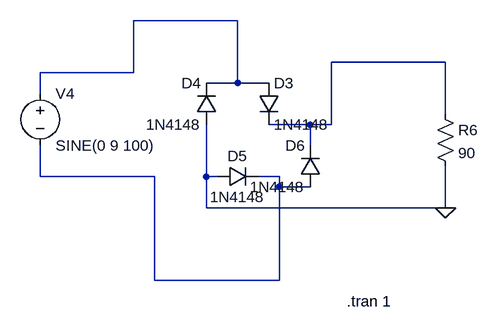
[diagram p0: schematic RectificationDraft.asc]
RectificationDraft.asc, the LTspice schematic file:
Version 4
SHEET 1 1012 680
WIRE 288 -576 128 -576
WIRE 608 -512 432 -512
WIRE 128 -496 128 -576
WIRE 128 -496 -16 -496
WIRE 288 -480 288 -576
WIRE 288 -480 240 -480
WIRE 336 -480 288 -480
WIRE -16 -464 -16 -496
WIRE 608 -432 608 -512
WIRE 400 -416 336 -416
WIRE 432 -416 432 -512
WIRE 432 -416 400 -416
WIRE 400 -384 400 -416
WIRE -16 -336 -16 -384
WIRE 160 -336 -16 -336
WIRE 240 -336 240 -416
WIRE 256 -336 240 -336
WIRE 352 -336 320 -336
WIRE 352 -320 352 -336
WIRE 400 -320 352 -320
WIRE 240 -288 240 -336
WIRE 608 -288 608 -352
WIRE 608 -288 240 -288
WIRE 160 -176 160 -336
WIRE 352 -176 352 -320
WIRE 352 -176 160 -176
FLAG 608 -288 0
SYMBOL res 592 -448 R0
SYMATTR InstName R6
SYMATTR Value 90
SYMBOL diode 320 -480 R0
SYMATTR InstName D3
SYMATTR Value 1N4148
SYMBOL diode 256 -416 R180
WINDOW 0 24 64 Left 2
WINDOW 3 24 0 Left 2
SYMATTR InstName D4
SYMATTR Value 1N4148
SYMBOL diode 256 -320 R270
WINDOW 0 32 32 VTop 2
WINDOW 3 0 32 VBottom 2
SYMATTR InstName D5
SYMATTR Value 1N4148
SYMBOL diode 416 -320 R180
WINDOW 0 24 64 Left 2
WINDOW 3 24 0 Left 2
SYMATTR InstName D6
SYMATTR Value 1N4148
SYMBOL voltage -16 -480 R0
SYMATTR InstName V4
SYMATTR Value SINE(0 9 100)
TEXT 456 -144 Left 2 !.tran 1

The netlist it stands for:
* RectificationDraft.asc
R6 N002 0 90
D3 N001 N002 1N4148
D4 0 N001 1N4148
D5 0 N003 1N4148
D6 N003 N002 1N4148
V4 N001 N003 SINE(0 9 100)
.model D D
.lib standard.dio
.tran 1
.backanno
.end